# Altium schematic sheet Board.SchDoc
size A3; SheetNumber: 1; SheetTotal: 1
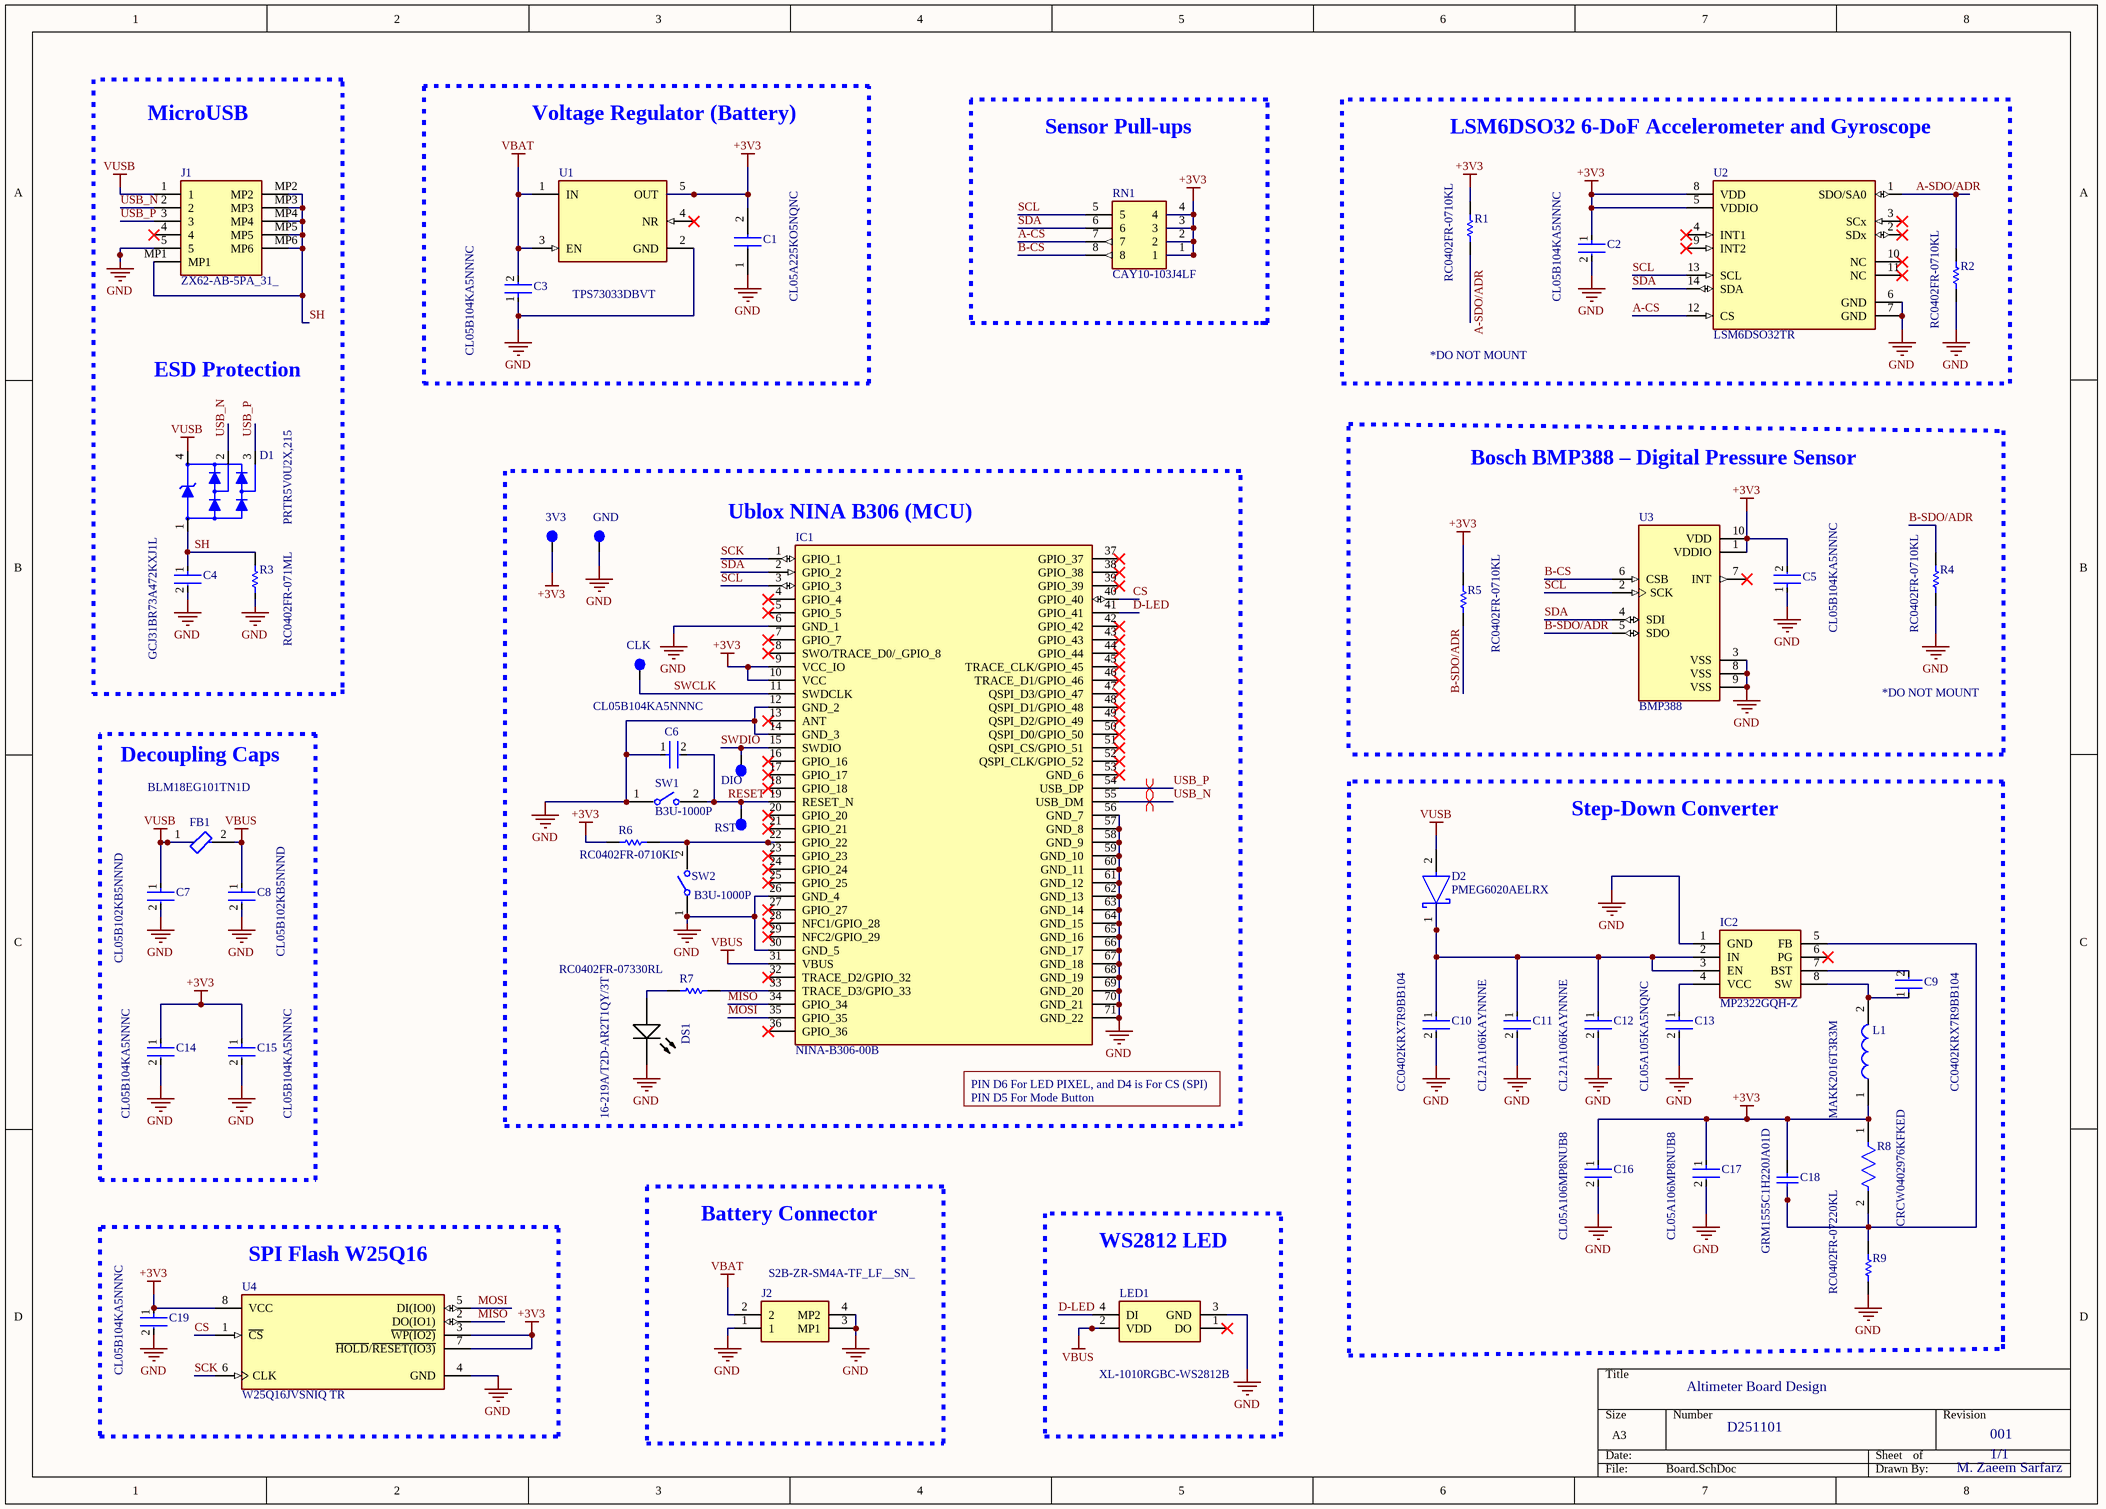
[diagram p0: Board.SchDoc]

## Parts
3V3  TP_1  [TestPoint1]  (value not drawn)  (no BOM)
C1  CL05A225KO5NQNC  [CAPC1005X60N]
C2  CL05B104KA5NNNC  [FP-CL830-IPC_C]
C3  CL05B104KA5NNNC  [FP-CL830-IPC_C]
C4  GCJ31BR73A472KXJ1L  [FP-GCJ31B-0_2-MFG]
C5  CL05B104KA5NNNC  [FP-CL830-IPC_C]
C6  CL05B104KA5NNNC  [FP-CL830-IPC_C]
C7  CL05B102KB5NNND  [FP-CL134-IPC_C]
C8  CL05B102KB5NNND  [FP-CL134-IPC_C]
C9  CC0402KRX7R9BB104  [FP-CC0402-MFG]
C10  CC0402KRX7R9BB104  [FP-CC0402-MFG]
C11  CL21A106KAYNNNE  [FP-CL21-IPC_A]
C12  CL21A106KAYNNNE  [FP-CL21-IPC_A]
C13  CL05A105KA5NQNC  [FP-CL542-IPC_C]
C14  CL05B104KA5NNNC  [FP-CL830-IPC_C]
C15  CL05B104KA5NNNC  [FP-CL830-IPC_C]
C16  CL05A106MP8NUB8  [FP-CL07-IPC_C]
C17  CL05A106MP8NUB8  [FP-CL07-IPC_C]
C18  GRM1555C1H220JA01D  [CAPC1005X55X25NL05T10]
C19  CL05B104KA5NNNC  [FP-CL830-IPC_C]
CLK  TP_1  [TestPoint1]  (value not drawn)  (no BOM)
D1  PRTR5V0U2X,215  [SOT143B]
D2  PMEG6020AELRX  [FP-SOD123W-MFG]
DIO  TP_1  [TestPoint1]  (value not drawn)  (no BOM)
DS1  16-219A/T2D-AR2T1QY/3T  [EVRL-0402-2_V]
FB1  BLM18EG101TN1D  [FP-BLM18-0_15-t0_5-MFG]
GND  TP_1  [TestPoint1]  (value not drawn)  (no BOM)
IC1  NINA-B306-00B  [NINAB30600B]
IC2  MP2322GQH-Z  [MP2322GQHZ]
J1  ZX62-AB-5PA_31_  [ZX62AB5PA31]
J2  S2B-ZR-SM4A-TF_LF__SN_  [S2BZRSM4ATFLFSN]
L1  MAKK2016T3R3M  [INDPM2016X100N]
LED1  XL-1010RGBC-WS2812B  [XL1010RGBCWS2812B]
R1  RC0402FR-0710KL  Mount: *DO NOT MOUNT  [RESC1005X40X25LL05T10]
R2  RC0402FR-0710KL  [RESC1005X40X25LL05T10]
R3  RC0402FR-071ML  [RESC1005X40X25NL05T10]
R4  RC0402FR-0710KL  Mount: *DO NOT MOUNT  [RESC1005X40X25LL05T10]
R5  RC0402FR-0710KL  [RESC1005X40X25LL05T10]
R6  RC0402FR-0710KL  [RESC1005X40X25LL05T10]
R7  RC0402FR-07330RL  [RESC1005X40X25LL05T10]
R8  CRCW0402976KFKED  [FP-CRCW0402-e3-IPC_A]
R9  RC0402FR-07220KL  [RESC1005X40X25LL05T10]
RN1  CAY10-103J4LF  [CAY10103J4LF]
RST  TP_1  [TestPoint1]  (value not drawn)  (no BOM)
SW1  B3U-1000P  [FP-B3U-1000P-MFG]
SW2  B3U-1000P  [FP-B3U-1000P-MFG]
U1  TPS73033DBVT  [FP-DBV0005A-IPC_A]
U2  LSM6DSO32TR  [FP-LGA-14L-DM00249496-MFG]
U3  BMP388  [PQFN50P200X200X80-10N]
U4  W25Q16JVSNIQ TR  [FP-W25Q16JVSNIQ_TR-IPC_A]

## Blocks framed on the sheet
Voltage Regulator (Battery): C1 C3 U1
Ublox NINA B306 (MCU): 3V3 C6 CLK DIO DS1 GND IC1 R6 R7 RST SW1 SW2
Decoupling Caps: C7 C8 C14 C15 FB1
Battery Connector: J2
SPI Flash W25Q16: C19 U4
WS2812 LED: LED1

## Nets
+3V3: 3V3.TP1 C1.2 C2.1 C5.2 C14.1 C15.1 C16.1 C17.1 C18.2 C19.1 IC1.9(VCC_IO) IC1.10(VCC) L1.1 R1.2 R5.2 R6.2 R8.1 RN1.1 RN1.2 RN1.3 RN1.4 U1.5(OUT) U2.5(VDDIO) U2.8(VDD) U3.1(VDDIO) U3.10(VDD) U4.3(~{WP(IO2)}) U4.7(~{HOLD}/~{RESET(IO3)}) U4.8(VCC)
GND: C1.1 C2.2 C3.1 C4.2 C5.1 C6.1 C7.2 C8.2 C10.2 C11.2 C12.2 C13.2 C14.2 C15.2 C16.2 C17.2 C19.2 DS1.2(K) GND.TP1 IC1.6(GND_1) IC1.12(GND_2) IC1.14(GND_3) IC1.26(GND_4) IC1.30(GND_5) IC1.56(GND_7) IC1.57(GND_8) IC1.58(GND_9) IC1.59(GND_10) IC1.60(GND_11) IC1.61(GND_12) IC1.62(GND_13) IC1.63(GND_14) IC1.64(GND_15) IC1.65(GND_16) IC1.66(GND_17) IC1.67(GND_18) IC1.68(GND_19) IC1.69(GND_20) IC1.70(GND_21) IC1.71(GND_22) IC2.1(GND) J1.5 J2.1 J2.3(MP1) J2.4(MP2) LED1.3(GND) R2.1 R3.1 R4.1 R9.2 SW1.1 SW2.1 U1.2(GND) U2.6(GND) U2.7(GND) U3.3(VSS) U3.8(VSS) U3.9(VSS) U4.4(GND)
VBAT: C3.2 J2.2 U1.1(IN) U1.3(EN)
VBUS: C8.1 FB1.2 IC1.31(VBUS) LED1.2(VDD)
VUSB: C7.1 D1.4(P$4) D2.2(A) FB1.1 J1.1
A-CS: RN1.7 U2.12(CS)
A-SDO/ADR: R1.1 R2.2 U2.1(SDO/SA0)
B-CS: RN1.8 U3.6(CSB)
B-SDO/ADR: R4.2 R5.1 U3.5(SDO)
CS: IC1.40(GPIO_40) U4.1(~{CS})
D-LED: IC1.41(GPIO_41) LED1.4(DI)
MISO: IC1.34(GPIO_34) U4.2(DO(IO1))
MOSI: IC1.35(GPIO_35) U4.5(DI(IO0))
RESET: C6.2 IC1.19(RESET_N) RST.TP1 SW1.2
SCK: IC1.1(GPIO_1) U4.6(CLK)
SCL: IC1.3(GPIO_3) RN1.5 U2.13(SCL) U3.2(SCK)
SDA: IC1.2(GPIO_2) RN1.6 U2.14(SDA) U3.4(SDI)
SH: C4.1 D1.1(P$1) J1.MP1 J1.MP2 J1.MP3 J1.MP4 J1.MP5 J1.MP6 R3.2
SWCLK: CLK.TP1 IC1.11(SWDCLK)
SWDIO: DIO.TP1 IC1.15(SWDIO)
USB_N: D1.2(P$2) IC1.55(USB_DM) J1.2
USB_P: D1.3(P$3) IC1.54(USB_DP) J1.3
NetC9_1: C9.1 IC2.8(SW) L1.2
NetC9_2: C9.2 IC2.7(BST)
NetC10_1: C10.1 C11.1 C12.1 D2.1(C) IC2.2(IN) IC2.3(EN)
NetC13_1: C13.1 IC2.4(VCC)
NetC18_1: C18.1 IC2.5(FB) R8.2 R9.1
NetDS1_1: DS1.1(A) R7.1
NetIC1_22: IC1.22(GPIO_22) R6.1 SW2.2
NetIC1_33: IC1.33(TRACE_D3/GPIO_33) R7.2

Not connected (* = marked no-connect by the designer): IC1 4(GPIO_4)* 5(GPIO_5)* 7(GPIO_7)* 8(SWO/TRACE_D0/_GPIO_8)* 13(ANT)* 16(GPIO_16)* 17(GPIO_17)* 18(GPIO_18)* 20(GPIO_20)* 21(GPIO_21)* 23(GPIO_23)* 24(GPIO_24)* 25(GPIO_25)* 27(GPIO_27)* 28(NFC1/GPIO_28)* 29(NFC2/GPIO_29)* 32(TRACE_D2/GPIO_32)* 36(GPIO_36)* 37(GPIO_37)* 38(GPIO_38)* 39(GPIO_39)* 42(GPIO_42)* 43(GPIO_43)* 44(GPIO_44)* 45(TRACE_CLK/GPIO_45)* 46(TRACE_D1/GPIO_46)* 47(QSPI_D3/GPIO_47)* 48(QSPI_D1/GPIO_48)* 49(QSPI_D2/GPIO_49)* 50(QSPI_D0/GPIO_50)* 51(QSPI_CS/GPIO_51)* 52(QSPI_CLK/GPIO_52)* 53(GND_6)*; IC2 6(PG)*; J1 4*; LED1 1(DO)*; U1 4(NR)*; U2 2(SDx)* 3(SCx)* 4(INT1)* 9(INT2)* 10(NC)* 11(NC)*; U3 7(INT)*

## Layout directives
differential pair: USB_N, USB_P

## Notes on the sheet
- MicroUSB
- Sensor Pull-ups
- LSM6DSO32 6-DoF Accelerometer and Gyroscope
- ESD Protection
- Bosch BMP388 – Digital Pressure Sensor
- Step-Down Converter
- PIN D5 For Mode Button
- (near IC1) PIN D6 For LED PIXEL, and D4 is For CS (SPI)
- Altimeter Board Design
- D251101
- 001
- 1/1
- M. Zaeem Sarfarz

## Library data of the parts
3V3 CLK DIO GND RST = TESTPOINT1
C1 = CL05A225KO5NQNC: Capacitor; Manufacturer_Name: SAMSUNG; Datasheet Link: https://product.samsungsem.com/mlcc/CL05A225KO5NQN.do; Height: 0.6mm; Manufacturer_Part_Number: CL05A225KO5NQNC; Mouser Part Number: N/A; Mouser Price/Stock: https://www.mouser.com/Search/Refine.aspx?Keyword=N%2FA; Arrow Part Number: CL05A225KO5NQNC; Arrow Price/Stock: https://www.arrow.com/en/products/cl05a225ko5nqnc/samsung-electro-mechanics
C2 C3 C5 C6 C14 C15 C19 = CMP-13271-001643-1: Cap Ceramic 100nF 25V X7R ±10% SMD 0402 +125°C Paper T/R; Case/Package: 0402; Voltage Rating: 25V; Capacitance: 100nF; Mount: Surface Mount; Voltage Rating (DC): 25V; Thickness: 0.022inch; Min Operating Temperature: -55°C; Width: 0.02inch; Tolerance: 10%; Packaging: Tape and Reel; Max Operating Temperature: 125°C; Length: 0.039inch; Case Code (Imperial): 0402; Case Code (Metric): 1005
C4 = CMP-06035-022072-1: 4700pF ±10%  1kV Ceramic Capacitor X7R 1206 (3216 Metric); Capacitance: 4.7nF; Voltage Rating: 1kV; Max Operating Temperature: 125°C; Width: 0.063inch; Packaging: Tape and Reel; Ratings: AEC-Q200; Thickness: 0.061inch; Min Operating Temperature: -55°C; Dielectric: X7R; Mount: Surface Mount; Features: Soft Termination; Tolerance: 10%; Length: 0.126inch; Case/Package: 1206; Depth: 1.6mm
C7 C8 = CMP-13271-004684-1: Cap Ceramic 1nF 50V X7R ±10% SMD 0402 +125°C Paper T/R; Voltage: 50V; RoHS Compliant: Yes; Radiation Hardening: No; Series: CL; Package Quantity: 50000; Width: 0.02inch; Packaging: Tape and Reel; Voltage Rating (DC): 50V; Min Operating Temperature: -55°C; Depth: 0.5mm; Thickness: 0.022inch; Construction: Flat; Height: 0.5mm; Length: 1mm; Case/Package: 0402; Mount: Surface Mount; Voltage Rating: 50V; Tolerance: 10%; Capacitance: 1nF; Max Operating Temperature: 125°C; Dielectric: X7R
C9 C10 = CMP-03422-001010-1: CAP CER 0.1UF 50V X7R 0402; Manufacturer: YAGEO; Capacitance: 100 nF; Temperature Coefficient: 30ppm/°C; Material: Ceramic; Value: 100 nF; Automotive Grade: NA; Tolerance: 0.1; Footprint Url: http://www.yageo.com/exep/pages/download/literatures/UPY-C_GEN_24.pdf; Category: Cap; Package: CC0402; Voltage Rating: 50 V; ComponentLink2Description: Datasheet; Temperature Characteristic: X7R; Device Class L1: Passive Components; Device Class L2: Capacitors; Digikey Description: CAP CER 0.1UF 50V X7R 0402; Octopart: https://octopart.com/cc0402krx7r9bb104-yageo-56536067; Device Class L3: Ceramic Capacitors; Height: 0.55mm; Temperature: -55°C to +125°C; Temperature Range High: +125°C; ComponentLink2URL: http://www.yageo.com/documents/recent/UPY-GP_NP0_16V-to-50V_16.pdf; Temperature Range Low: -55°C; RoHS: TRUE; Ipc Land Pattern Name: CAPC10050X50; Lead Free: Yes; Automotive: No; Manufacturer Part Number: CC0402KRX7R9BB104
C11 C12 = CMP-13271-002975-1: CL21 Series 0805 10uF 25V ±10% Tolerance X5R Multilayer Ceramic Chip Capacitor; Case Code (Imperial): 0805; Length: 2mm; Case/Package: 0805; Packaging: Tape and Reel; Width: 0.049inch; Tolerance: 10%; Mount: Surface Mount; Min Operating Temperature: -55°C; Thickness: 0.057inch; Height: 1.25mm; Dielectric: X5R; Package Quantity: 1; Depth: 1.25mm; Capacitance: 10uF; Voltage Rating: 25V; Case Code (Metric): 2012; Max Operating Temperature: 85°C; Radiation Hardening: No
C13 = CMP-13271-001051-1: Cap Ceramic 1uF 25V X5R ±10% SMD 0402 +85°C Paper T/R; Radiation Hardening: No; Lead Free: Lead Free; Capacitance: 1uF; Package Quantity: 10000; Max Operating Temperature: 85°C; Voltage Rating: 25V; Case/Package: 0402; Min Operating Temperature: -55°C; Packaging: Tape and Reel; Tolerance: 10%; Height: 0.5mm; Thickness: 0.022inch; Case Code (Metric): 1005; Width: 0.02inch; Case Code (Imperial): 0402; Dielectric: X5R; Length: 1mm; Mount: Surface Mount; Material: Ceramic; Depth: 0.5mm
C16 C17 = CMP-13271-002778-1: Cap Ceramic 10uF 10V X5R ±20% SMD 0402 +85°C Paper T/R; Length: 0.039inch; Mount: Surface Mount; Case Code (Imperial): 0402; Capacitance: 10uF; Max Operating Temperature: 85°C; Voltage Rating: 10V; Min Operating Temperature: -55°C; Case/Package: 0402; Thickness: 0.035inch; Width: 0.02inch; Case Code (Metric): 1005; Packaging: Tape and Reel; Tolerance: 20%
C18 = CMP-2008-04302-1: Manufacturer: Murata; Part Number: GRM1555C1H220JA01D
D1 = PRTR5V0U2X,215: Ultra low capacitance double rail-to-rail ESD protection diode; Package: None; MP: PRTR5V0U2X,215; Price: None; Availability: Unavailable; Value: *
D2 = CMP-14398-000040-1: DIODE SCHOTTKY 60V 2A CFP3; RoHS Compliant: Yes
DS1 = CMP-2100-03575-1: Chip LED, White, 5 V, 10 mA, 30 mW, -40 to 85 degC, 2-Pin SMD (0402), RoHS, Tape and Reel; Manufacturer: Everlight Electronics; Power Rating: 30mW; Luminous Intensity: 360mcd; Forward Current: 5mA; Forward Voltage: 2.6V; Lens Colour: Yellow; Viewing Angle: 130degrees; Min Operating Temperature: -40degC; Datasheet URL: http://www.everlight.com/file/ProductFile/16-219A-T2D-AR2T1QY-3T.pdf; Case/Package: 0402; Package Description: 2-Pin Surface Mount Device, Body 1 x 0.5 mm; RoHSCompliant: true; Datasheet Version: Rev. 5, 04/2013; Max Operating Temperature: 85degC; Packaging: TapeandReel; Package Reference: 0402; Package Quantity: 3000; Manufacturer URL: http://www.everlight.com/; Illumination Colour: White; Mount: Standard
FB1 = CMP-0686-00530-3: Chip Ferrite Bead, 0603, 100Ω @ 100MHz, 25%, 0.045Ω, 2A; DC Resistance (DCR): 45mR; Number of Circuits: 1; Impedance: 100R; Max Current Rating: 2A; Depth: 0.8mm; Case Code (Imperial): 0603; Tolerance: 25%; Packaging: Tape and Reel; Core Material: Ferrite; Material: Ferrite; Termination: SMD/SMT; Case Code (Metric): 1608; Package Quantity: 1; Length: 1.6mm; Contact Plating: Tin; Lead Free: Lead Free; Max Operating Temperature: 125°C; Height: 0.8mm; Current Rating: 2A; REACH SVHC: No SVHC; Max DC Current: 2A; Min Operating Temperature: -55°C; Case/Package: 0603; Number of Pins: 2; Width: 0.8mm; Test Frequency: 100MHz; Number of Lines: 1
IC1 = NINA-B306-00B: Integrated Circuit; Manufacturer_Name: u-blox; Datasheet Link: https://www.u-blox.com/en/docs/UBX-17052099; Manufacturer_Part_Number: NINA-B306-00B; Mouser Part Number: 377-NINA-B306-00B; Mouser Price/Stock: https://www.mouser.co.uk/ProductDetail/u-blox/NINA-B306-00B?qs=zW32dvEIR3uPiIbgcFbQtQ%3D%3D; Arrow Part Number: NINA-B306-00B; Arrow Price/Stock: https://www.arrow.com/en/products/nina-b306-00b/u-blox?utm_currency=USD&region=nac
IC2 = MP2322GQH-Z: Integrated Circuit; Manufacturer_Name: Monolithic Power Systems (MPS); Height: 0.9mm; Manufacturer_Part_Number: MP2322GQH-Z; Mouser Part Number: 946-MP2322GQH-Z; Mouser Price/Stock: https://www.mouser.co.uk/ProductDetail/Monolithic-Power-Systems-MPS/MP2322GQH-Z?qs=byeeYqUIh0PNRfOYikm40g%3D%3D
J1 = ZX62-AB-5PA_31_: Connector; Manufacturer_Name: Hirose; Manufacturer_Part_Number: ZX62-AB-5PA(31); Datasheet Link: https://componentsearchengine.com/Datasheets/1/ZX62-AB-5PA(31).pdf; Height: 2.8mm; Mouser Part Number: 798-ZX62-AB-5PA31; Mouser Price/Stock: https://www.mouser.co.uk/ProductDetail/Hirose-Connector/ZX62-AB-5PA31?qs=4J5DPWWS9ECs22kuZOYOxg%3D%3D; Arrow Part Number: ZX62-AB-5PA(31); Arrow Price/Stock: https://www.arrow.com/en/products/zx62-ab-5pa-31/hirose-electric
J2 = S2B-ZR-SM4A-TF_LF__SN_: Connector; Manufacturer_Name: JST (JAPAN SOLDERLESS TERMINALS); Manufacturer_Part_Number: S2B-ZR-SM4A-TF(LF)(SN); Datasheet Link: https://www.jst-mfg.com/product/pdf/eng/eZH.pdf; Height: 3.7mm; Mouser Part Number: 306-S2BZRSM4ATFLFSN; Mouser Price/Stock: https://www.mouser.co.uk/ProductDetail/JST-Commercial/S2B-ZR-SM4A-TFLFSN?qs=QpmGXVUTftFg0hrqdkvc8w%3D%3D; Arrow Part Number: S2B-ZR-SM4A-TF(LF)(SN); Arrow Price/Stock: https://www.arrow.com/en/products/s2b-zr-sm4a-tf-lf-sn/jst-manufacturing?region=europe
L1 = MAKK2016T3R3M: Inductor; Manufacturer_Name: TAIYO YUDEN; Datasheet Link: https://mouser.componentsearchengine.com/Datasheets/1/MAKK2016T3R3M.pdf; Height: 1mm; Manufacturer_Part_Number: MAKK2016T3R3M; Mouser Part Number: 963-MAKK2016T3R3M; Mouser Price/Stock: https://www.mouser.co.uk/ProductDetail/TAIYO-YUDEN/MAKK2016T3R3M?qs=Z6svWd%2FY2UTQY1%2FASu%252BfUw%3D%3D
LED1 = XL-1010RGBC-WS2812B: LED; Manufacturer_Name: XINGLIGHT; Datasheet Link: https://datasheet.lcsc.com/lcsc/2301111010_XINGLIGHT-XL-1010RGBC-WS2812B_C5349953.pdf; Height: 0.8mm; Manufacturer_Part_Number: XL-1010RGBC-WS2812B
R1 R2 R4-R6 = CMP-2002-07353-1: Manufacturer: Yageo / Phycomp; Part Number: RC0402FR-0710KL
R3 = CMP-2002-07490-1: Manufacturer: Yageo / Phycomp; Part Number: RC0402FR-071ML
R7 = CMP-2002-07613-1: Manufacturer: Yageo / Phycomp; Part Number: RC0402FR-07330RL
R8 = CMP-2002-00281-4: RES Thick Film, 976kΩ, 1%, 0.063W, 100ppm/°C, 0402; Voltage Rating: 50V; Resistance: 976kR; Power Rating: 63mW; Height: 0.016inch; Composition: Thick Film; Package Quantity: 10; Weight: 2.3E-05oz; Case Code (Imperial): 0402; Lead Free: Lead Free; Temperature Coefficient: 100ppm/°C; Contact Plating: Tin; Tolerance: 1%; Packaging: Tape and Reel; Voltage Rating (DC): 50V; Number of Pins: 2; Case Code (Metric): 1005; Military Standard: Not; Length: 1mm; Number of Terminations: 2; Min Operating Temperature: -55°C; Max Power Dissipation: 63mW; Depth: 0.5mm; Max Operating Temperature: 155°C; Width: 0.5mm; Radiation Hardening: No; Features: Automotive AEC-Q200; Case/Package: 0402
R9 = CMP-1011-00772-2: Manufacturer: Yageo / Phycomp; Part Number: RC0402FR-07220KL
RN1 = CAY10-103J4LF: Resistor Network; Manufacturer_Name: Bourns; Datasheet Link: https://www.bourns.com/pdfs/CAY10.pdf; Height: 0.45mm; Manufacturer_Part_Number: CAY10-103J4LF; Mouser Part Number: 652-CAY10-103J4LF; Mouser Price/Stock: https://www.mouser.co.uk/ProductDetail/Bourns/CAY10-103J4LF?qs=FaUPen95qPYx83jflZJwIw%3D%3D; Arrow Part Number: CAY10-103J4LF; Arrow Price/Stock: https://www.arrow.com/en/products/cay10-103j4lf/bourns?region=europe
SW1 SW2 = CMP-2100-03586-2: SWITCH TACTILE SPST-NO 0.05A 12V; Contact Resistance: 100mR; Operating Force: 1.5N; Max Current Rating: 50mA; Switch Travel: 0.15mm; Actuator Type: Standard; Mechanical Life: 200000Cycles; Ratings: Dust Proof; Illumination Type: Non-Illuminated; Throw Configuration: SPST; Actuator Length: 0.4mm; Switch Function: Off-Mom; Height: 1.2mm; Width: 3mm; Weight: 0.000776oz; Contact Material: Silver; Max Voltage Rating (DC): 12V; Insulation Resistance: 100MR; Lead Free: Lead Free; Current Rating: 50mA; Termination: SMD/SMT; Length: 4mm; Voltage Rating (DC): 12V; Contact Current Rating: 50mA; Orientation: Straight; Depth: 2.5mm; Max Operating Temperature: 70°C; Packaging: Tape and Reel; Min Operating Temperature: -25°C; Package Quantity: 1; Mount: Surface Mount; Electrical Life: 200000Cycles
U1 = CMP-04917-000130-1: IC REG LINEAR 3.3V 200MA SOT23-5; Output Type: Fixed; Output Voltage Accuracy: 2%; Min Current Limit: 285mA; Number of Outputs: 1; Input Bias Current: 170uA; Max Supply Voltage: 5.5V; Polarity: Positive; Min Supply Voltage: 2.7V; Max Power Dissipation: 560mW; Dropout Voltage: 120mV; Min Operating Temperature: -40°C; Nominal Output Voltage: 3.3V; Max Output Current: 200mA; Termination: SMD/SMT; Length: 2.9mm; REACH SVHC: No SVHC; Number of Regulators: 1; Output Current: 200mA; Series: -; Number of Pins: 5; Packaging: Tape and Reel; Case/Package: SOT-23; Height: 1.15mm; Max Operating Temperature: 85°C; Width: 1.6mm; Mount: Surface Mount; Output Voltage: 3.3V; Quiescent Current: 170uA; Power Rating: 560mW; Contact Plating: Gold; Max Input Voltage: 5.5V; Radiation Hardening: No; Power Dissipation: 560mW; Max Output Voltage: 3.3V; Accuracy: 2%; Min Input Voltage: 2.7V; Package Quantity: 250; Lead Free: Lead Free; RoHS Compliant: Yes
U2 = CMP-12177-000015-1: INEMO INERTIAL MODULE: 3D ACCELE
U3 = BMP388: P-Sensor SPI I2C 1, 25 Bar SMD; Package: None; Price: None; Value: *; MP: BMP388; Availability: Unavailable; Parameter 1: *
U4 = CMP-78876-000009-2: IC FLASH 16MBIT SPI/QUAD 8SOIC; NexarPartId: 75645707; Max Supply Voltage: 3.6V; Memory Size: 2MB; Interface: SPI; Access Time: 5ms; Min Supply Voltage: 2.7V; RoHS: Non-Compliant; Min Operating Temperature: -40°C; Memory Type: FLASH; Height: 1.75mm; Schedule B: 8542320070, 8542320070; Ambient Temperature Range High: 85°C; Max Operating Temperature: 85°C